# EasyEDA schematic AdEMNEA.json
TITLE: Power Supply Module; REV: 1.1; Date: 2024-02-06; Sheet: 1/1; Drawn By: MORIS AND BRIGHT; Company: IoT-ra Lab
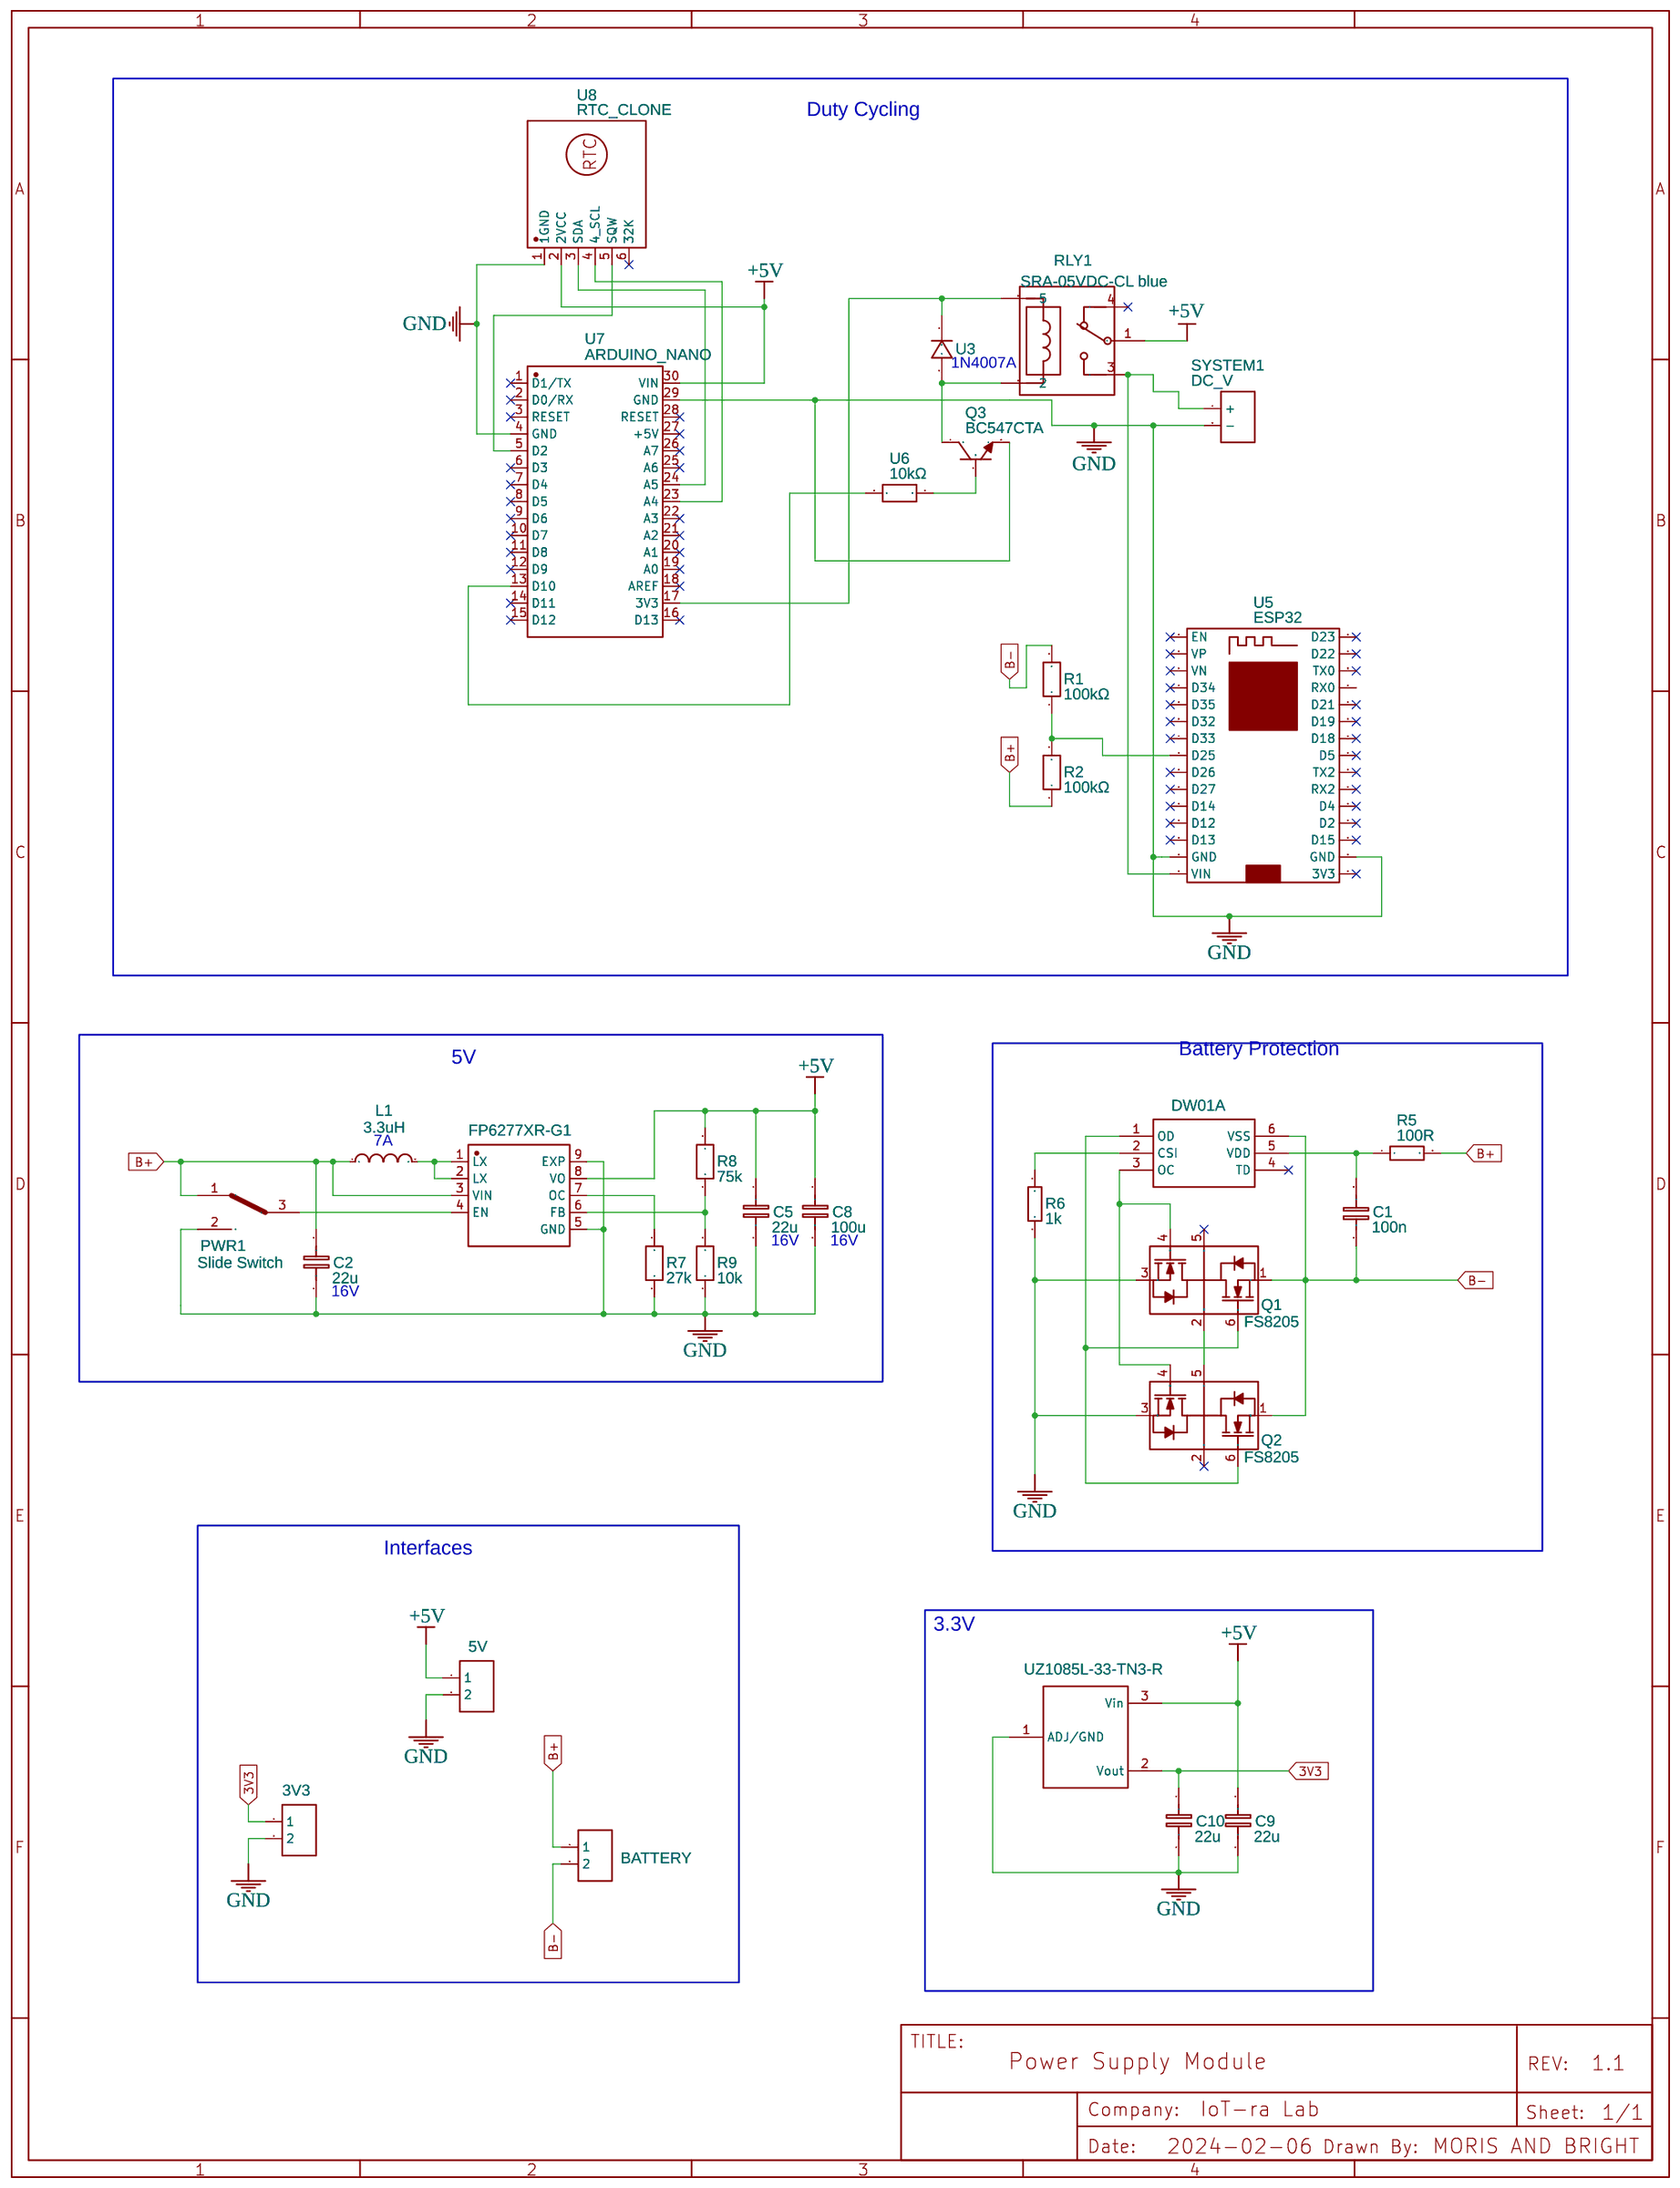
[diagram p0: schematic sheet]

## Parts
3V3  Connector  [HDR-1X2/2.54]
5V  Connector  [HDR-1X2/2.54]
BATTERY  Connector  [HDR-1X2/2.54]
C1  100n  [0805]
C2  22u  [0805]
C5  22u  [0805]
C8  100u  [1206]
C9  22u  [0805]
C10  22u  [0805]
L1  3.3uH  [IND-SMD_L7.8-W7.0_0630]
PWR1  Slide Switch  [SLIDE SWITCH DPDT 1P2T]
Q1  FS8205  [SOT-23-6]
Q2  FS8205  [SOT-23-6]
Q3  BC547CTA  [TO-92-3_L4.8-W3.7-P2.54-L]
R1  100kΩ  [RES-TH_BD2.4-L6.3-P10.30-D0.6]
R2  100kΩ  [RES-TH_BD2.4-L6.3-P10.30-D0.6]
R5  100R  [0805]
R6  1k  [0805]
R7  27k  [0805]
R8  75k  [0805]
R9  10k  [0805]
RLY1  SRA-05VDC-CL blue  [RELAY-TH_SRA-9VDC-CL]
SYSTEM1  DC_V  [BORNERA DOS TERMINALES TERMINAL BLOCK 5MM]
U1  FP6277XR-G1  [SOP-8_EP_150MIL]
U2  DW01A  [SOT-23-6]
U3  1N4007A  [DO-41_BD2.4-L4.7-P8.70-D0.9-RD]
U4  UZ1085L-33-TN3-R  [TO-252-2_L6.6-W6.1-P4.58-BR]
U5  ESP32  [ESP32]
U6  10kΩ  [RES-TH_BD2.4-L6.3-P10.30-D0.6]
U7  ARDUINO_NANO  [COMM-TH_ARDUINO_NANO]
U8  RTC_CLONE  [RTC3231]

## Library data of the parts
3V3 5V BATTERY = -: Supplier: LCSC; Manufacturer: BOOMELE; Manufacturer Part: 2.54-1*2PFemale; image: //image.lceda.cn/szlcsc/C49661.jpg; Supplier Part: C49661
C1 = Cap_0805_EU: Manufacturer Part: CC0805KRX7R9BB104; Supplier: LCSC; Manufacturer: YAGEO; Supplier Part: C49678
C2 C5 C9 C10 = Cap_0805_EU: Manufacturer Part: CL21A226MAQNNNE; Supplier: LCSC; Manufacturer: SAMSUNG; Supplier Part: C45783
C8 = Cap_0805_EU: Manufacturer Part: CL31A107MPHNNNE; Supplier: LCSC; Manufacturer: SAMSUNG; Supplier Part: C52922
L1 = JSHC0650H-3R3M-G: Supplier: LCSC; Supplier Part: C334093; Manufacturer: Jinlai; Contributor: LCSC
PWR1 = -: Manufacturer Part: New SchematicLib; Contributor: Zfjn03u
Q1 Q2 = FS8205: Supplier: LCSC; Manufacturer: FORTUNE; LCSC Assembly: Yes; image: //image.lceda.cn/szlcsc/C32254.jpg; Supplier Part: C32254; SMT Type: Basic; Contributor: Stefan Wagner
Q3 = BC547CTA: Contributor: LCSC; Supplier: LCSC; Supplier Part: C900799; Manufacturer: onsemi(安森美); JLCPCB Part Class: Extended Part
R1 R2 = RNF14FAE100K: Contributor: lcsc; Supplier: LCSC; Supplier Part: C2644165; Manufacturer: SEI(Stackpole Electronics Inc.)
R5 = Res_0805(1/8W)_EU: Manufacturer Part: 0805W8F1000T5E; Supplier: LCSC; Manufacturer: UniOhm; Supplier Part: C17408
R6 = Res_0805(1/8W)_EU: Manufacturer Part: 0805W8F1001T5E; Supplier: LCSC; Manufacturer: UniOhm; Supplier Part: C17513
R7 = Res_0805(1/8W)_EU: Manufacturer Part: 0805W8F2702T5E; Supplier: LCSC; Manufacturer: UniOhm; Supplier Part: C17593
R8 = Res_0805(1/8W)_EU: Manufacturer Part: 0805W8F7502T5E; Supplier: LCSC; Manufacturer: UniOhm; Supplier Part: C17819
R9 = Res_0805(1/8W)_EU: Manufacturer Part: 0805W8F1002T5E; Supplier: LCSC; Manufacturer: UniOhm; Supplier Part: C17414
RLY1 = SRA-05VDC-CL blue: Supplier: LCSC; Manufacturer: 松乐; Manufacturer Part: SRA-05VDC-CL; Supplier Part: C87714; JLCPCB Part Class: Extended Part
SYSTEM1 = DC_V: Contributor: omabistudio
U1 = FP6277XR-G1: Supplier: LCSC; Manufacturer: Feeling Technology; Contributor: LCSC; Supplier Part: C88312; LCSC Assembly: Yes; SMT Type: Extend
U2 = -: Supplier: LCSC; Manufacturer: FM; Supplier Part: C85680
U3 = 1N4007A: Contributor: lcsc; Supplier: LCSC; Supplier Part: C5336145; Manufacturer: LRC(乐山无线电)
U4 = UZ1085L-33-TN3-R: Supplier: LCSC; Manufacturer: UTC; Supplier Part: C125622; LCSC Assembly: Yes; SMT Type: Extend
U5 = ESP32: catid: 20; Contributor: osama91; link: https://www.amazon.ca/gp/product/B07KTV2RRM/ref=crt_ewc_img_huc_1?ie=UTF8&psc=1&smid=A36ZH2MCHPKXUA; sim: true
U6 = FM0207FTE52-10K: Contributor: lcsc; Supplier: LCSC; Supplier Part: C1377488; Manufacturer: YAGEO(国巨); JLCPCB Part Class: Extended Part
U7 = ARDUINO_NANO: Contributor: lcsc; Supplier: LCSC; Supplier Part: C9900017879; Manufacturer: null; JLCPCB Part Class: Extended Part
U8 = RTC_CLONE: Contributor: James2

## Nets
3V3: 3V3.1 C10.1 U4.2(Vout)
+5V: 5V.1 C5.1 C8.1 C9.1 R8.2 RLY1.1 U1.8(VO) U4.3(Vin) U7.30(VIN) U8.2(2VCC)
GND: 3V3.2 5V.2 C2.2 C5.2 C8.2 C9.2 C10.2 PWR1.2 Q1.3(S2) Q2.3(S2) Q3.3(E) R6.1 R7.1 R9.1 SYSTEM1.2(-) U1.5(GND) U1.9(EXP) U4.1(ADJ/GND) U5.14(GND) U5.17(GND) U7.4(GND) U7.29(GND) U8.1(1GND)
B+: BATTERY.1 C2.1 L1.1 PWR1.1 R2.1 R5.2 U1.3(VIN)
B-: BATTERY.2 C1.1 Q1.1(S1) Q2.1(S1) R1.2 U2.6(VSS)
Net-(C1-2): C1.2 R5.1 U2.5(VDD)
Net-(L1-2): L1.2 U1.1(LX) U1.2(LX)
Net-(PWR1-3): PWR1.3 U1.4(EN)
Net-(Q1-2): Q1.2(D12) Q2.5(D12)
Net-(Q1-4): Q1.4(G2) Q2.4(G2) U2.3(OC)
Net-(Q1-6): Q1.6(G1) Q2.6(G1) U2.1(OD)
Net-(Q3-1): Q3.1(C) RLY1.2 U3.2
Net-(Q3-2): Q3.2(B) U6.2
Net-(R1-1): R1.1 R2.2 U5.8(D25)
Net-(R6-2): R6.2 U2.2(CSI)
Net-(R7-2): R7.2 U1.7(OC)
Net-(R8-1): R8.1 R9.2 U1.6(FB)
Net-(RLY1-3): RLY1.3 SYSTEM1.1(+) U5.15(VIN)
Net-(RLY1-5): RLY1.5 U3.1 U7.17(3V3)
Net-(U6-1): U6.1 U7.13(D10)
Net-(U7-5): U7.5(D2) U8.5(SQW)
Net-(U7-23): U7.23(A4) U8.4(4 SCL)
Net-(U7-24): U7.24(A5) U8.3(SDA)

Not connected (* = marked no-connect by the designer): Q1 5(D12)*; Q2 2(D12)*; RLY1 4*; U2 4(TD)*; U5 1(EN)* 2(VP)* 3(VN)* 4(D34)* 5(D35)* 6(D32)* 7(D33)* 9(D26)* 10(D27)* 11(D14)* 12(D12)* 13(D13)* 16(3V3)* 18(D15)* 19(D2)* 20(D4)* 21(RX2)* 22(TX2)* 23(D5)* 24(D18)* 25(D19)* 26(D21)* 27(RX0) 28(TX0)* 29(D22)* 30(D23)*; U7 1(D1/TX)* 2(D0/RX)* 3(RESET)* 6(D3)* 7(D4)* 8(D5)* 9(D6)* 10(D7)* 11(D8)* 12(D9)* 14(D11)* 15(D12)* 16(D13)* 18(AREF)* 19(A0)* 20(A1)* 21(A2)* 22(A3)* 25(A6)* 26(A7)* 27(+5V)* 28(RESET)*; U8 6(32K)*

## Notes on the sheet
- Duty Cycling
- 1N4007A
- 5V
- Battery Protection
- 7A
- 16V
- 16V
- 16V
- Interfaces
- 3.3V
